# EAGLE design myf17 (EAGLE 6.2)
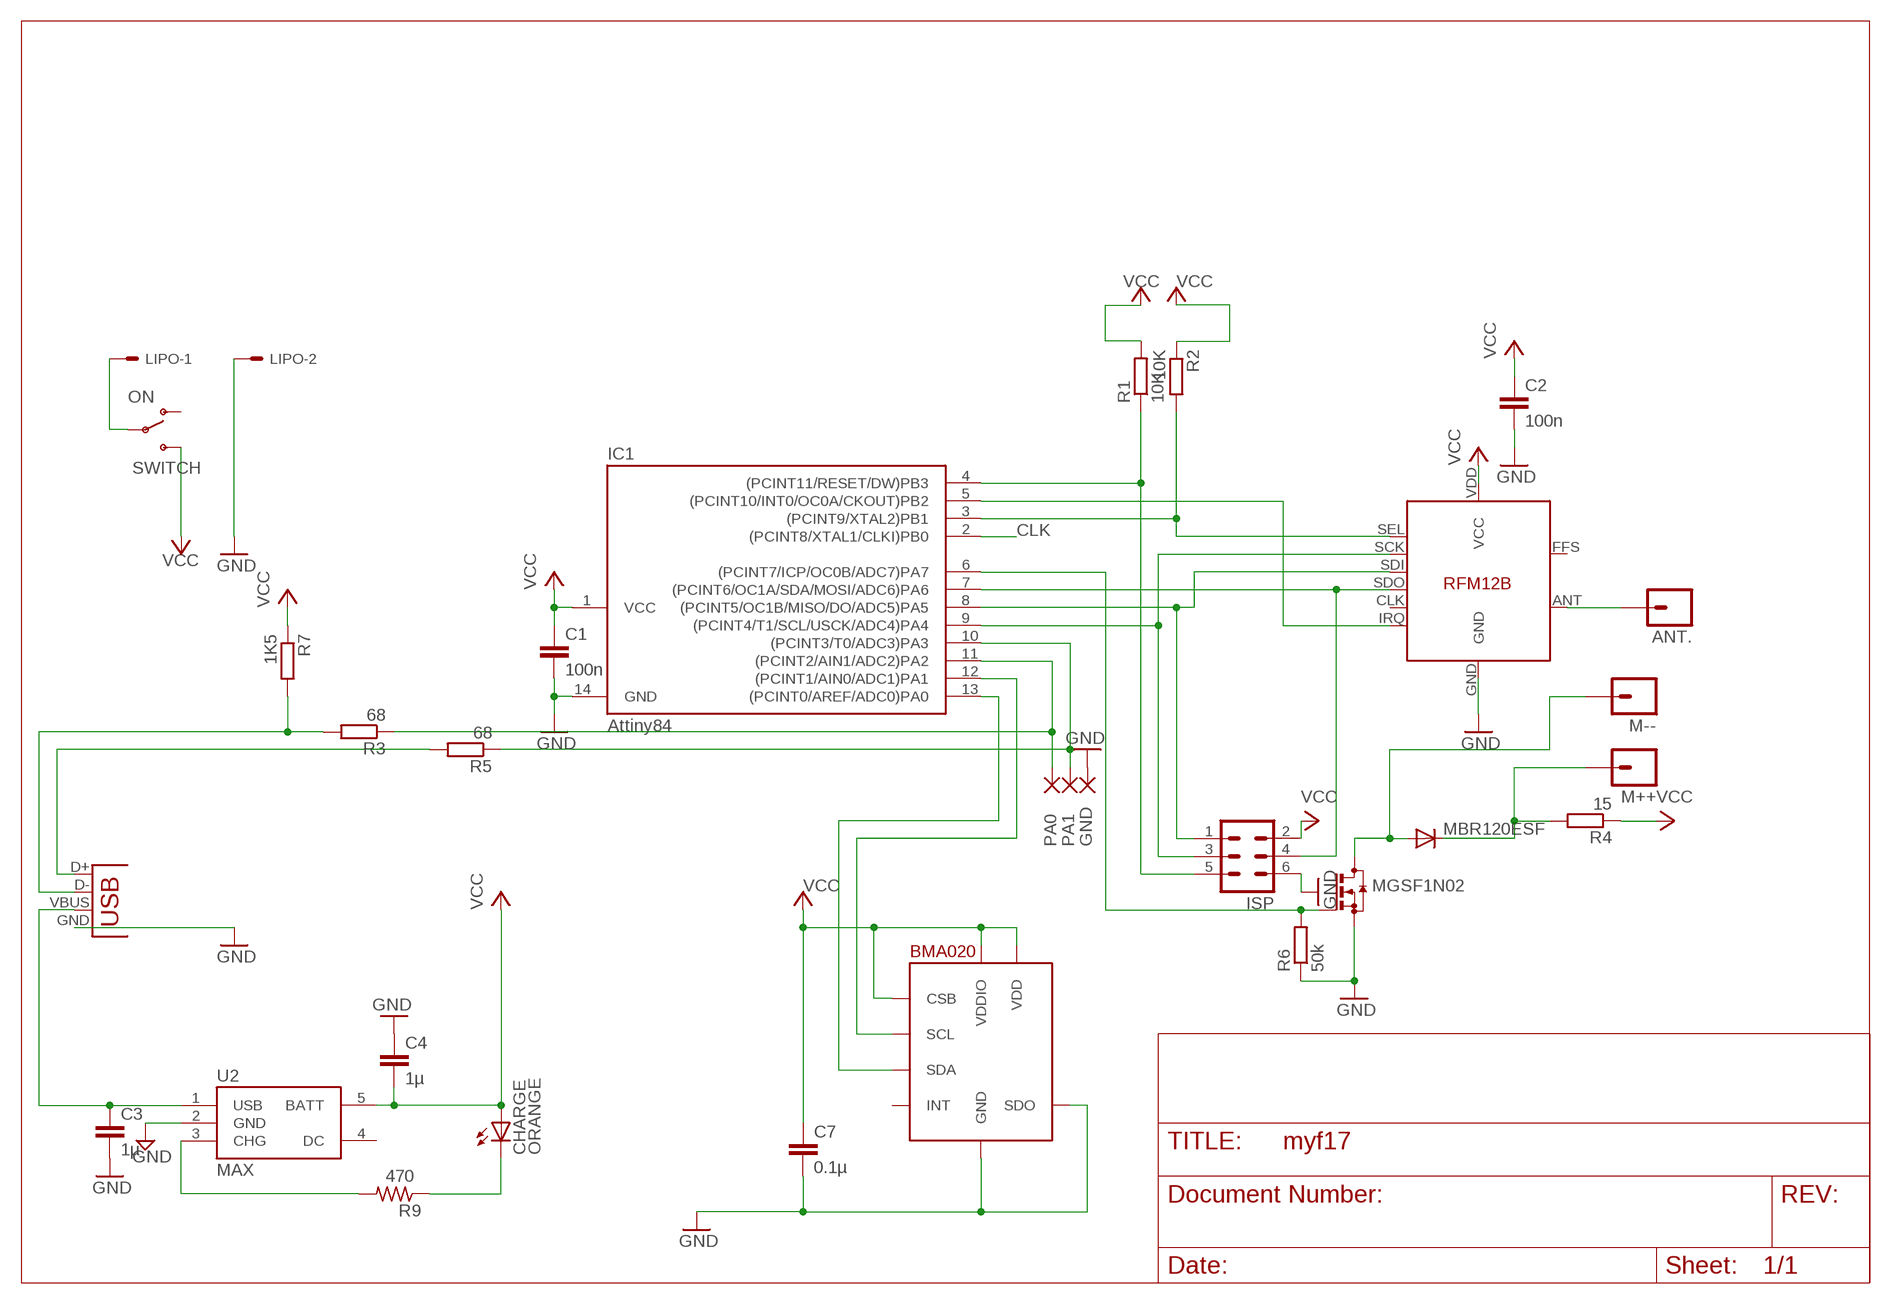
[diagram p0: schematic, sheet 1]

## Parts
ANT.  M01PTH  [1X01]
BMA020  BMA020  [LBA-12]
C1  100n  C-EUC0603K  [C0603K]
C2  100n  C-EUC0603K  [C0603K]
C3  1µ  CAP0603-CAP  [0603-CAP]
C4  1µ  CAP0603-CAP  [0603-CAP]
C7  0.1µ  CAP0603-CAP  [0603-CAP]
CHARGE  ORANGE  LED0603  [LED-0603]
GND  SMD2  [SMD1,27-2,54]
IC1  Attiny84  TINY24/44/84-SSU  [SOIC14]
ISP  MA03-2S  [MA03-2-0.8]
LIPO  SM02B-SRSS-TB  [SM02B-SRSS-TB]
M++  M01PTH  [1X01]
M--  M01PTH  [1X01]
MBR120ESF  CGRM4001-G  [SOD-123_MINI-SMA]
MGSF1N02  BSS123  [SOT23]
PA0  SMD2  [SMD1,27-2,54]
PA1  SMD2  [SMD1,27-2,54]
R1  10K  R-EU_R0603  [R0603]
R2  10K  R-EU_R0603  [R0603]
R3  68  R-EU_R0603  [R0603]
R4  15  R-EU_R0603  [R0603]
R5  68  R-EU_R0603  [R0603]
R6  50k  R-EU_R0603  [R0603]
R7  1K5  R-EU_R0603  [R0603]
R9  470  R-US_R0603  [R0603]
RFM12B  RFM12B  [RFM12B]
SWITCH  ON  SWITCH-SPDTSMD2  [SWITCH-SPDT-SMD]
U2  MAX  MAX1555  [SOT23-5]
USB  USB-MICROB  [USB-MICROB]

## Nets
CLK: IC1.2((PCINT8/XTAL1/CLKI)PB0)
GND: BMA020.P$3(GND) BMA020.P$7(SDO) C1.2 C2.2 C3.2 C4.1 C7.2 GND.1(P) IC1.14(GND) ISP.6 LIPO.2 MGSF1N02.2(S) R6.1 RFM12B.GND U2.2(GND) USB.GND
LED: BMA020.P$8(SDA) IC1.13((PCINT0/AREF/ADC0)PA0)
N$1: IC1.4((PCINT11/RESET/DW)PB3) ISP.5 R1.1
N$2: IC1.3((PCINT9/XTAL2)PB1) R2.2 RFM12B.SEL
N$3: ANT..1 RFM12B.ANT
N$4: IC1.9((PCINT4/T1/SCL/USCK/ADC4)PA4) ISP.3 RFM12B.SCK
N$5: IC1.8((PCINT5/OC1B/MISO/DO/ADC5)PA5) ISP.1 RFM12B.SDI
N$6: IC1.7((PCINT6/OC1A/SDA/MOSI/ADC6)PA6) ISP.4 RFM12B.SDO
N$7: IC1.5((PCINT10/INT0/OC0A/CKOUT)PB2) RFM12B.IRQ
N$8: IC1.6((PCINT7/ICP/OC0B/ADC7)PA7) MGSF1N02.1(G) R6.2
N$9: IC1.10((PCINT3/T0/ADC3)PA3) PA1.1(P) R5.1
N$10: IC1.11((PCINT2/AIN1/ADC2)PA2) PA0.1(P) R3.1
N$11: BMA020.P$6(SCL) IC1.12((PCINT1/AIN0/ADC1)PA1)
N$13: M++.1 MBR120ESF.C R4.2
N$14: M--.1 MBR120ESF.A MGSF1N02.3(D)
N$15: C3.1 U2.1(USB) USB.VBUS
N$16: LIPO.1 SWITCH.2(P)
N$17: R3.2 R7.2 USB.D-
N$18: R5.2 USB.D+
N$23: CHARGE.C R9.1
N$26: R9.2 U2.3(CHG)
VCC: BMA020.P$2(VDD) BMA020.P$5(CSB) BMA020.P$9(VDDIO) C1.1 C2.1 C4.2 C7.1 CHARGE.A IC1.1(VCC) ISP.2 R1.2 R2.1 R4.1 R7.1 RFM12B.VDD(VCC) SWITCH.3(S) U2.5(BATT)
Unconnected: BMA020.P$4(INT) RFM12B.CLK RFM12B.FFS SWITCH.1(O) U2.4(DC)

## Library data of the parts
ANT. M++ M-- = SparkFun:M01: Header 1 Standard 1-pin 0.1" header. Use with straight break away headers (SKU : PRT-00116), right angle break away headers (PRT-00553), swiss pins (PRT-00743), machine pins (PRT-00117), and female headers (PRT-00115).
BMA020 = JeeLabs:BMA020
C1 C2 = rcl:C-EU: CAPACITOR, European symbol
C3 C4 C7 = SparkFun:CAP: Capacitor Standard 0603 ceramic capacitor, and 0.1" leaded capacitor.
CHARGE = SparkFun:LED: LEDs Standard schematic elements and footprints for 5mm, 3mm, 1206, and 0603 sized LEDs. 5mm - Spark Fun Electronics SKU : COM-00529 (and others)
GND PA0 PA1 = wirepad:SMD2: SMD PAD
IC1 = avr-7:TINY24/44/84
ISP = JeeLabs:MA03-2: PIN HEADER
LIPO = con-jst2:?M02B-SRSS-TB: Disconnectable Crimp style connector, 1.0mm pitch 2 contacts
MBR120ESF = diode:CGRM400*-G: Molded plasitc,JEDEC SOD-123/Mini SMA Source: Comchip CGRM4001-G.pdf
MGSF1N02 = transistor-small-signal:BSS123: N-CHANNEL MOS FET
R1-R7 = resistor:R-EU_: RESISTOR, European symbol
R9 = rcl:R-US_: RESISTOR, American symbol
RFM12B = JeeParts:RFM12B
SWITCH = SparkFun-Electromechanical:SWITCH-SPDT: SPDT Switch Simple slide switch, Spark Fun Electronics SKU : COM-00102 DPDT SMT slide switch, AYZ0202, SWCH-08179
U2 = SparkFun:MAX1555: MAX1555 Lithium Charger IC SOT-23 Lithium Polymer charging IC. Schematic element and footprint proven. Spark Fun Electronics SKU : COM-00674
USB = SparkFun:USB: USB Connectors USB-B-PTH is fully proven SKU : PRT-00139 USB-miniB is fully proven SKU : PRT-00587 USB-A-PCB is untested. USB-A-H is throughly reviewed, but untested. Spark Fun Electronics SKU : PRT-00437 USB-B-SMT is throughly reviewed, but untested. Needs silkscreen touching up. USB-A-S has not been used/tested USB-MB-H has not been used/tested

## Net classes
0 default: width 0.2 mm
1 power: width 0.305 mm

## Board
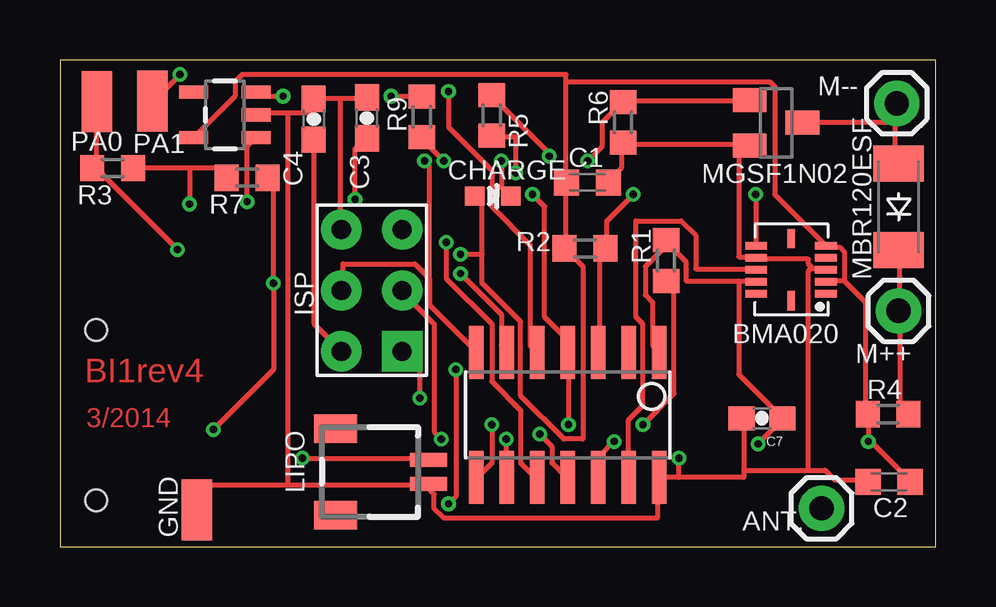
[diagram p1: board, top side]
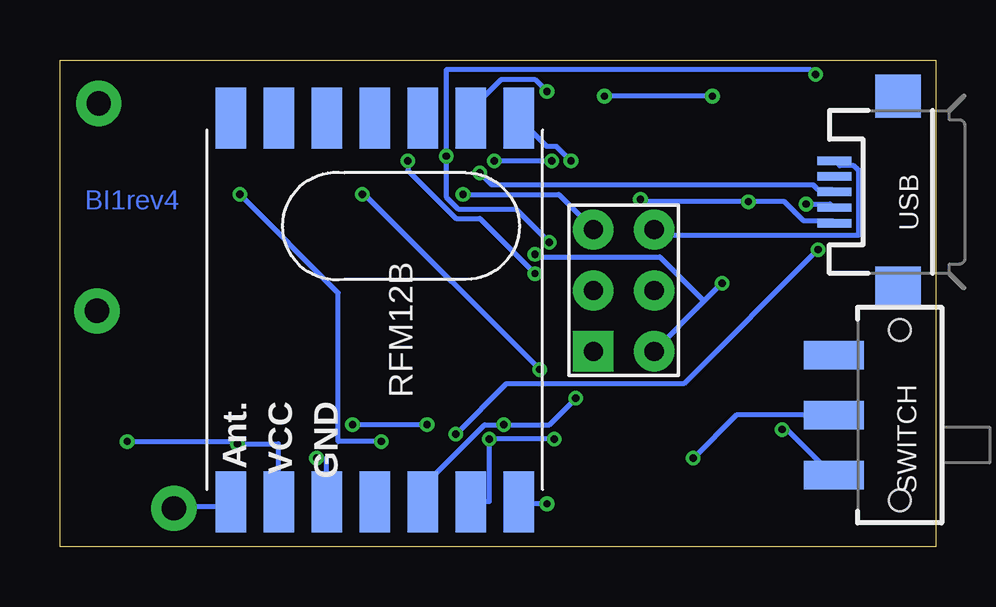
[diagram p2: board, bottom side, seen from below]

Size 36.5 x 20.31 mm. Coordinates in mm from the lower left corner, seen from the top.
Outline: 0,0 36.5,0 36.5,20.31 0,20.31 0,0
Copper layers (1*2*15*16): Top 0.035mm / dielectric 0.2mm / layer 2 0.0175mm / dielectric 1.1mm / layer 15 0.0175mm / dielectric 0.2mm / Bottom 0.035mm
Design rules: minimum track width 6mil, minimum drill 12mil, track to track 6mil, track to pad 6mil, pad to pad 6mil, via to via 6mil, smd to smd 0mil, copper to edge 10mil, drill to drill 10mil, minimum pad ring 6mil, minimum via ring 6mil, stop-mask expansion 2mil, vias tented up to drill 25mil, thermal gap 10mil

### Footprints (pad centres in the part's own frame; a part is rotated, then mirrored left to right if it is on the bottom)
1X01 = drill 1.016 pad 1.88: 1 0,0
LBA-12 = smd 0.9 x 0.32: P$1 -1.45,1; P$2 -1.45,0.5; P$3 -1.45,0; P$4 -1.45,-0.5; P$5 -1.45,-1; P$6 1.45,-1; P$7 1.45,-0.5; P$8 1.45,0; P$9 1.45,0.5; P$10 1.45,1 | smd 0.32 x 0.8: P$11 0,1.3; P$12 0,-1.3
C0603K = smd 1.05 x 1.08: 1 -0.875,0; 2 0.875,0
0603-CAP = smd 1.1 x 1: 1 -0.85,0; 2 0.85,0
LED-0603 = smd 0.8 x 0.8: A 0,-0.75; C 0,0.75
SMD1,27-2,54 = smd 1.27 x 2.54: 1 0,0
SOIC14 = smd 0.61 x 2.21: 1 -3.81,-2.603; 2 -2.54,-2.603; 3 -1.27,-2.603; 4 0,-2.603; 5 1.27,-2.603; 6 2.54,-2.603; 7 3.81,-2.603; 8 3.81,2.603; 9 2.54,2.603; 10 1.27,2.603; 11 0,2.603; 12 -1.27,2.603; 13 -2.54,2.603; 14 -3.81,2.603
MA03-2-0.8 = drill 0.8 pad 1.676 square: 1 -2.54,-1.27 | drill 0.8 pad 1.676: 2 -2.54,1.27; 3 0,-1.27; 4 0,1.27; 5 2.54,-1.27; 6 2.54,1.27
SM02B-SRSS-TB = smd 0.6 x 1.55: 1 -0.5,2.975; 2 0.5,2.975 | smd 1.2 x 1.8: FIT@1 -1.8,-0.9; FIT@2 1.8,-0.9
SOD-123_MINI-SMA = smd 1.5 x 2.1: A 1.8,0; C -1.8,0
SOT23 = smd 1 x 1.4: 1 -0.95,-1.1; 2 0.95,-1.1; 3 0,1.1
R0603 = smd 1 x 1.1: 1 -0.85,0; 2 0.85,0
RFM12B = smd 2.54 x 1.27: ANT 8,-6; CLK -8,-2; FFS -8,2; GND 8,-2; IRQ -8,4; P$8 -8,0; P$10 -8,-4; P$12 -8,-6; P$16 8,0; SCK 8,4; SDI 8,2; SDO -8,6; SEL 8,6; VDD 8,-4
SWITCH-SPDT-SMD = smd 1.2 x 2.5: 1 -2.5,-2.75; 2 0,-2.75; 3 2.5,-2.75 | hole 0.9: -3.55,0; 3.55,0
SOT23-5 = smd 0.55 x 1.2: 1 -0.95,-1.3; 2 0,-1.3; 3 0.95,-1.3; 4 0.95,1.3; 5 -0.95,1.3
USB-MICROB = smd 0.35 x 1.4: D+ 0,2.65; D- -0.65,2.65; GND 1.3,2.65; ID 0.65,2.65; VBUS -1.3,2.65 | smd 1.8 x 1.9: MT1 -4,0; MT2 4,0

### Placement (x,y rotation side)
ANT.  31.75,1.61 0 top
BMA020  30.48,11.57 180 top
C1  21.99,15.2 0 top
C2  34.56,2.71 180 top
C3  12.79,17.89 90 top
C4  10.58,17.84 270 top
C7  29.27,5.37 180 top
CHARGE  18.04,14.63 270 top
GND  5.71,1.54 0 top
IC1  21.17,5.5 180 top
ISP  13,10.7 90 top
LIPO  12.39,3.13 270 top
M++  34.96,9.85 0 top
M--  34.89,18.5 0 top
MBR120ESF  34.97,14.19 90 top
MGSF1N02  29.85,17.69 270 top
PA0  1.54,18.57 0 top
PA1  3.84,18.58 0 top
R1  25.26,11.94 90 top
R2  21.88,12.45 0 top
R3  2.2,15.8 0 top
R4  34.52,5.54 0 top
R5  18,18 270 top
R6  23.47,17.71 90 top
R7  7.8,15.4 180 top
R9  15.08,17.94 90 top
RFM12B  23.38,9.89 270 bottom
SWITCH  1.5,5.5 270 bottom
U2  6.88,18.02 90 top
USB  1.57,14.81 90 bottom

### Tracks (layer width: path | path; a pad name or v marks a point on that pad's centre or on a via)
GND  (via drill 0.3)
  Top 0.2: 11.7,18.7 12.7,18.7 C3.2 | 11.7,18.7 10.6,18.7 C4.1 10.5,18.6 10.5,18.1 9.5,18.1 | 9.5,18.1 8.2,18.1 U2.2 | 11.7,18.7 11.7,13.3 ISP.6 | 31.35,11.65 31.4,11.6 31.9,11.6 BMA020.P$3 | 31.35,11.65 31.2,11.8 31.2,12 29.1,12 BMA020.P$7 29,12.1 28.3,12.1 28.3,16.8 | C1.2 22.9,15.3 23.4,15.8 23.4,16.8 R6.1 23.5,16.8 28.3,16.8 | 28.3,16.8 28.7,16.8 MGSF1N02.2 28.3,16.8 | 9.5,2.6 5.8,2.6 5.8,1.6 GND.1 | 9.5,2.6 15.3,2.6 LIPO.2 15.3,2.5 15.6,2.2 15.6,1.6 16,1.2 24.9,1.2 24.9,2.8 IC1.14 25,2.9 25.8,2.9 | 28.5,3.2 31.2,3.2 | 31.2,3.2 31.9,3.2 32.3,2.8 33.6,2.8 C2.2 | 28.5,3.2 28.5,5.3 C7.2 | 25.8,2.9 28.5,2.9 28.5,3.2 | 25.8,2.9 v25.8,3.7 | 31.35,11.65 31.2,11.5 31.2,3.2 | 9.5,2.6 9.5,18.1
  Bottom 0.2: USB.GND 4.2,16.1 4,15.9 3.4,15.9 3.2,15.7 3.2,13 11.5,13 11.7,13.2 ISP.6 | v25.8,3.7 25.4,3.7 25.4,1.9 RFM12B.GND
LED
  Top 0.2: BMA020.P$8 29,11.6 26.5,11.6 26.5,13 25.9,13.6 24,13.6 24,9.6 24.3,9.3 24.3,5.9 23.7,5.3 IC1.13
N$1  (via drill 0.3)
  Top 0.2: v24.3,5.1 25.6,6.4 25.6,10.7 25.3,11 R1.1 | v21.2,5.1 21.2,8.1 IC1.4 21.1,8.2 21.1,8.7 20.2,9.6 20.2,14.2 v19.7,14.7
  Bottom 0.2: v21.2,5.1 v24.3,5.1 | v19.7,14.7 15.7,14.7 14.3,13.3 ISP.5
N$2  (via drill 0.3)
  Top 0.2: IC1.3 22.5,8.2 22.5,12.2 22.7,12.4 R2.2 22.8,12.5 22.8,13.6 v23.9,14.7 | v16.2,1.8 16.5,2.1 v16.5,7.4
  Bottom 0.2: v16.2,1.8 17.3,1.8 RFM12B.SEL | v16.5,7.4 23.8,14.7 v23.9,14.7
N$3
  Bottom 0.2: RFM12B.ANT 29.4,1.8 29.5,1.7 31.7,1.7 ANT..1
N$4  (via drill 0.3)
  Top 0.2: v18.6,4.5 18.6,2.9 IC1.9 | v15.9,4.5 15.6,4.8 15.6,9.3 14.3,10.6 ISP.3
  Bottom 0.2: RFM12B.SCK 19.3,1.9 18.6,1.9 v18.6,4.5 v15.9,4.5
N$5  (via drill 0.3)
  Top 0.2: v18,5.1 18,3.5 17.4,2.9 IC1.8 | v15,6.2 15,7.4 14.3,8.1 ISP.1
  Bottom 0.2: RFM12B.SDI 21.3,1.9 21.3,2.6 18.8,5.1 v18,5.1 16.1,5.1 v15,6.2
N$6  (via drill 0.3)
  Top 0.2: 15.35,11.25 14.8,11.8 11.8,11.8 11.8,10.7 ISP.4 | 15.35,11.25 15.4,11.2 15.4,10.1 17.3,8.2 IC1.7 | v15.2,16.1 15.4,15.9 15.4,11.3 15.35,11.25
  Bottom 0.2: v15.2,16.1 15.8,16.7 16.2,16.7 17.3,17.8 RFM12B.SDO
N$7  (via drill 0.3)
  Top 0.2: v16.2,19 16.2,17.5 18,15.7 18,14.2 19.6,12.6 19.6,8.4 19.8,8.2 IC1.5
  Bottom 0.2: v16.2,19 16.7,19.5 18.1,19.5 19.3,18.3 19.3,17.9 RFM12B.IRQ
N$8  (via drill 0.3)
  Top 0.2: MGSF1N02.1 28.7,18.6 23.5,18.6 R6.2 23.4,18.5 22.6,17.7 22.6,16.7 v22,16.1 | v16.7,11.4 18.4,9.7 18.4,8.4 18.6,8.2 IC1.6
  Bottom 0.2: v16.7,11.4 19,13.7 20,13.7 22,15.7 v22,16.1
N$9  (via drill 0.3)
  Top 0.2: v20.4,16.3 20.4,16.4 18,18.8 R5.1 | v5,19.7 3.9,18.6 PA1.1 | v16.1,12.7 16.1,11.2 18,9.3 18,6.9 19.2,5.7 19.2,3.5 19.8,2.9 IC1.10
  Bottom 0.2: v5,19.7 5.2,19.9 20.4,19.9 v20.4,16.3 20.4,14.6 19.9,14.1 17.5,14.1 v16.1,12.7
N$10  (via drill 0.3)
  Top 0.2: PA0.1 1.5,18.5 1.5,15.9 1.4,15.8 R3.1 1.5,15.8 v4.9,12.4 | v20,4.7 20.5,4.2 20.5,3.5 21.1,2.9 IC1.11
  Bottom 0.2: v20,4.7 17.9,6.8 10.5,6.8 v4.9,12.4
N$11  (via drill 0.3)
  Top 0.2: v29,14.7 29,12.6 BMA020.P$6 | v23.1,4.4 22.5,3.8 22.5,2.9 IC1.12
  Bottom 0.2: v29,14.7 24.9,10.6 24.9,4.4 v23.1,4.4
N$13
  Top 0.2: R4.2 35.3,5.6 35,5.9 35,9.8 M++.1 35,9.9 35,12.3 MBR120ESF.C
N$14
  Top 0.2: 34.8,17.7 31,17.7 MGSF1N02.3 | 34.8,17.7 34.8,18.4 M--.1 34.8,17.7 | 34.8,17.7 34.8,16.1 34.9,16 MBR120ESF.A
N$15  (via drill 0.3)
  Top 0.2: v12.3,14.5 12.3,16.6 12.7,17 C3.1 | v7.8,14.4 7.8,16.7 8.1,17 U2.1
  Bottom 0.2: v12.3,14.5 12.2,14.4 v7.8,14.4 6.3,14.4 5.5,13.6 4.3,13.6 USB.VBUS
N$16  (via drill 0.3)
  Top 0.2: v10.1,3.7 15.3,3.7 LIPO.1
  Bottom 0.2: v10.1,3.7 8.3,5.5 SWITCH.2
N$17  (via drill 0.3)
  Top 0.2: 5.4,15.8 6.9,15.8 6.9,15.4 R7.2 | 5.4,15.8 R3.2 | 5.4,15.8 v5.4,14.3
  Bottom 0.2: v5.4,14.3 4.4,14.3 4.3,14.2 USB.D-
N$18  (via drill 0.3)
  Top 0.2: v19,15.6 19,17.1 18,17.1 R5.2
  Bottom 0.2: v19,15.6 18.5,15.1 5.1,15.1 4.9,14.9 4.3,14.9 USB.D+
N$23  (via drill 0.3)
  Top 0.2: v18.4,16.1 18.4,15 18.7,14.7 CHARGE.C | v16,16.1 15.1,17 R9.1
  Bottom 0.2: v16,16.1 v18.4,16.1
N$26  (via drill 0.3)
  Top 0.2: v13.8,18.8 15,18.8 R9.2 | v9.3,18.8 8.2,18.8 8.2,18.9 U2.3
  Bottom 0.2: v9.3,18.8 v13.8,18.8
VCC  (via drill 0.3)
  Top 0.2: R7.1 8.7,15.4 8.9,15.2 v8.9,11 8.9,7.4 v6.4,4.9 | C4.2 10.6,16.9 10.6,9.3 11.7,8.2 ISP.2 | 28.3,11.1 26.1,11.1 26.1,11.9 25.3,12.7 R1.2 25.3,12.6 24.4,11.7 24.4,10.5 24.7,10.2 24.7,8.4 24.9,8.2 IC1.1 | 28.3,11.1 29,11.1 BMA020.P$9 | 28.3,11.1 28.3,7.2 30.1,5.4 C7.1 30.1,5.3 v29.1,4.3 | 32.7,11.1 32,11.1 BMA020.P$2 | 32.7,11.1 32.7,12.3 32.5,12.5 32,12.5 BMA020.P$5 31.9,12.6 29.8,14.7 29.8,19.2 29.6,19.4 21.1,19.4 | 33.75,4.45 33.7,4.5 33.7,5.5 R4.1 33.6,5.6 33.6,10.2 32.7,11.1 | 33.75,4.45 35.4,2.8 C2.1 | 17.6,12.2 17.6,11 19.2,9.4 19.2,6.3 21,4.5 21.8,4.5 21.8,11.7 21.1,12.4 R2.1 21.1,12.5 C1.1 21.1,15.3 21.1,19.4 | 17.6,12.2 17.6,14.3 17.3,14.6 CHARGE.A | 21.1,19.4 21.1,19.7 7.6,19.7 7.3,19.4 7.3,18.8 5.6,17.1 U2.5 | v33.7,4.4 33.75,4.45 | 17.6,12.2 v16.7,12.2
  Bottom 0.2: 9.65,10.25 11.7,8.2 ISP.2 | 9.65,10.25 v8.9,11 | v6.4,4.9 6.2,4.9 4.3,3 SWITCH.3 | RFM12B.VDD 27.4,1.9 27.4,4.3 v29.1,4.3 29.2,4.4 v33.7,4.4 | 9.65,10.25 11.5,12.1 16.6,12.1 v16.7,12.2

### Text on the board
Top: BI1rev4 | 3/2014
Bottom: BI1rev4